# EAGLE design schema_attiny85_Charger_NiMH (EAGLE 7.2.0)
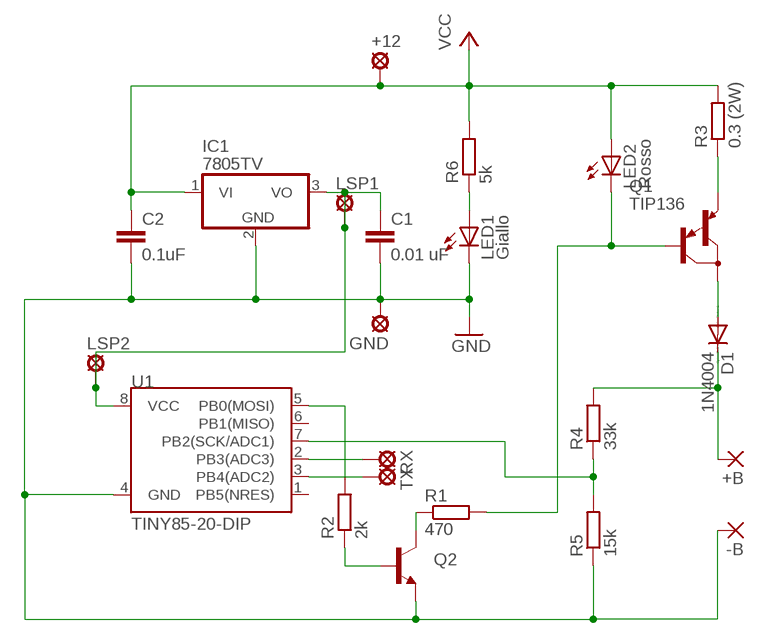
[diagram p0: schematic, sheet 1]

## Parts
+12  LSP10  [LSP10]
+B  1,6/0,9  [1,6/0,9]
-B  1,6/0,9  [1,6/0,9]
C1  0.01 uF  C-EU050-025X075  [C050-025X075]
C2  0.1uF  C-EU050-025X075  [C050-025X075]
D1  1N4004  [DO41-10]
GND  LSP10  [LSP10]
IC1  7805TV  [TO220V]
LED1  Giallo  LED5MM  [LED5MM]
LED2  Rosso  LED5MM  [LED5MM]
LSP1  LSP10  [LSP10]
LSP2  LSP10  [LSP10]
Q1  TIP136  [TO220]
Q2  TRANSISTOR_NPNBC547  [TO-92-AMMO]
R1  470  R-EU_0204/7  [0204/7]
R2  2k  R-EU_0204/7  [0204/7]
R3  0.3 (2W)  R-EU_0204/7  [0204/7]
R4  33k  R-EU_0204/7  [0204/7]
R5  15k  R-EU_0204/7  [0204/7]
R6  5k  R-EU_0204/7  [0204/7]
RX  LSP10  [LSP10]
TX  LSP10  [LSP10]
U1  TINY85-20-DIP  ATTINY45TINY85-20-DIP  [DIP08]

## Nets
GND232: -B.1(P) C1.2 C2.2 GND.MP IC1.2(GND) LED1.K(C) Q2.3(E) R5.1 U1.4(GND) ; supply symbol labelled GND
N$1: Q2.2(B) R2.1
N$2: C1.1 IC1.3(VO) LSP1.MP LSP2.MP U1.8(VCC)
N$3: D1.A Q1.2(C)
N$4: LED1.A R6.1
N$5: LED2.K(C) Q1.1(B) R1.2
N$6: Q1.3(E) R3.1
N$7: RX.MP U1.2(PB3(ADC3))
N$8: +B.1(P) D1.C R4.2
N$9: R4.1 R5.2 U1.7(PB2(SCK/ADC1))
N$10: TX.MP U1.3(PB4(ADC2))
N$13: Q2.1(C) R1.1
N$15: R2.2 U1.5(PB0(MOSI))
VCC: +12.MP C2.1 IC1.1(VI) LED2.A R3.2 R6.2
Unconnected: U1.1(PB5(NRES)) U1.6(PB1(MISO))

## Library data of the parts
+12 GND LSP1 LSP2 RX TX = solpad:LSP10: SOLDER PAD drill 1.0 mm, distributor Buerklin, 12H555
+B -B = wirepad:1,6/0,9: THROUGH-HOLE PAD
C1 C2 = rcl:C-EU: CAPACITOR, European symbol
D1 = diode:1N4004: DIODE general purpose rectifier, 1 A
IC1 = linear:78*: Positive VOLTAGE REGULATOR Source: http://cache.national.com/ds/LM/LM78L05.pdf http://www.fairchildsemi.com/ds/LM/LM7805.pdf
LED1 LED2 = led:LED: LED OSRAM: - CHIPLED LG R971, LG N971, LY N971, LG Q971, LY Q971, LO R971, LY R971 LH N974, LH R974 LS Q976, LO Q976, LY Q976 LO Q996 - Hyper CHIPLED LW Q18S LB Q993, LB Q99A, LB R99A - SideLED LS A670, LO A670, LY A670, LG A670, LP A670 LB A673, LV A673, LT A673, LW A673 LH A674 LY A675 LS A676, LA A676, LO A676, LY A676, LW A676 LS A679, LY A679, LG A679 - Hyper Micro SIDELED® LS Y876, LA Y876, LO Y876, LY Y876 LT Y87S - SmartLED LW L88C, LW L88S LB L89C, LB L89S, LG L890 LS L89K, LO L89K, LY L89K LS L896, LA L896, LO L896, LY L896 - TOPLED LS T670, LO T670, LY T670, LG T670, LP T670 LSG T670, LSP T670, LSY T670, LOP T670, LYG T670 LG T671, LOG T671, LSG T671 LB T673, LV T673, LT T673, LW T673 LH T674 LS T676, LA T676, LO T676, LY T676, LB T676, LH T676, LSB T676, LW T676 LB T67C, LV T67C, LT T67C, LS T67K, LO T67K, LY T67K, LW E67C LS E67B, LA E67B, LO E67B, LY E67B, LB E67C, LV E67C, LT E67C LW T67C LS T679, LY T679, LG T679 LS T770, LO T770, LY T770, LG T770, LP T770 LB T773, LV T773, LT T773, LW T773 LH T774 LS E675, LA E675, LY E675, LS T675 LS T776, LA T776, LO T776, LY T776, LB T776 LHGB T686 LT T68C, LB T68C - Hyper Mini TOPLED® LB M676 - Mini TOPLED Santana® LG M470 LS M47K, LO M47K, LY M47K Source: http://www.osram.convergy.de LUXEON: - LUMILED® LXK2-PW12-R00, LXK2-PW12-S00, LXK2-PW14-U00, LXK2-PW14-V00 LXK2-PM12-R00, LXK2-PM12-S00, LXK2-PM14-U00 LXK2-PE12-Q00, LXK2-PE12-R00, LXK2-PE12-S00, LXK2-PE14-T00, LXK2-PE14-U00 LXK2-PB12-K00, LXK2-PB12-L00, LXK2-PB12-M00, LXK2-PB14-N00, LXK2-PB14-P00, LXK2-PB14-Q00 LXK2-PR12-L00, LXK2-PR12-M00, LXK2-PR14-Q00, LXK2-PR14-R00 LXK2-PD12-Q00, LXK2-PD12-R00, LXK2-PD12-S00 LXK2-PH12-R00, LXK2-PH12-S00 LXK2-PL12-P00, LXK2-PL12-Q00, LXK2-PL12-R00 Source: www.luxeon.com KINGBRIGHT: KA-3528ASYC Source: www.kingbright.com
Q1 = transistor-pnp:TIP136: PNP Darlington Transistor
Q2 = SparkFun-DiscreteSemi:TRANSISTOR_NPN: Generic NPN BJT MMBT2222A - TRANS-08049 (SOT-23, 1A 40V) MPSA42 - TRANS-09116 (SOT-23, 500mA 300V) MMBT5088LT1G - TRANS-11160 (SOT-23, 50 mA 30V) BC547 - COM-08928 <http://www.sparkfun.com/products/8928> (TO-92 45V 100mA) (1.Collector 2.Base 3.Emitter) 2N3904 - COM-00521 <http://www.sparkfun.com/products/521> (TO-92 40V 200mA) (1.Emitter 2.Base 3.Collector) P2N2222A - COM-12852 <http://www.sparkfun.com/products/12852> (TO-92 40V 600mA) (1.Collector 2.Base 3.Emitter)
R1-R6 = resistor:R-EU_: RESISTOR, European symbol
U1 = SparkFun-DigitalIC:ATTINY45: Atmel 8-pin 2/4/8kB flash uC; PROD_ID: IC-09445

## Board
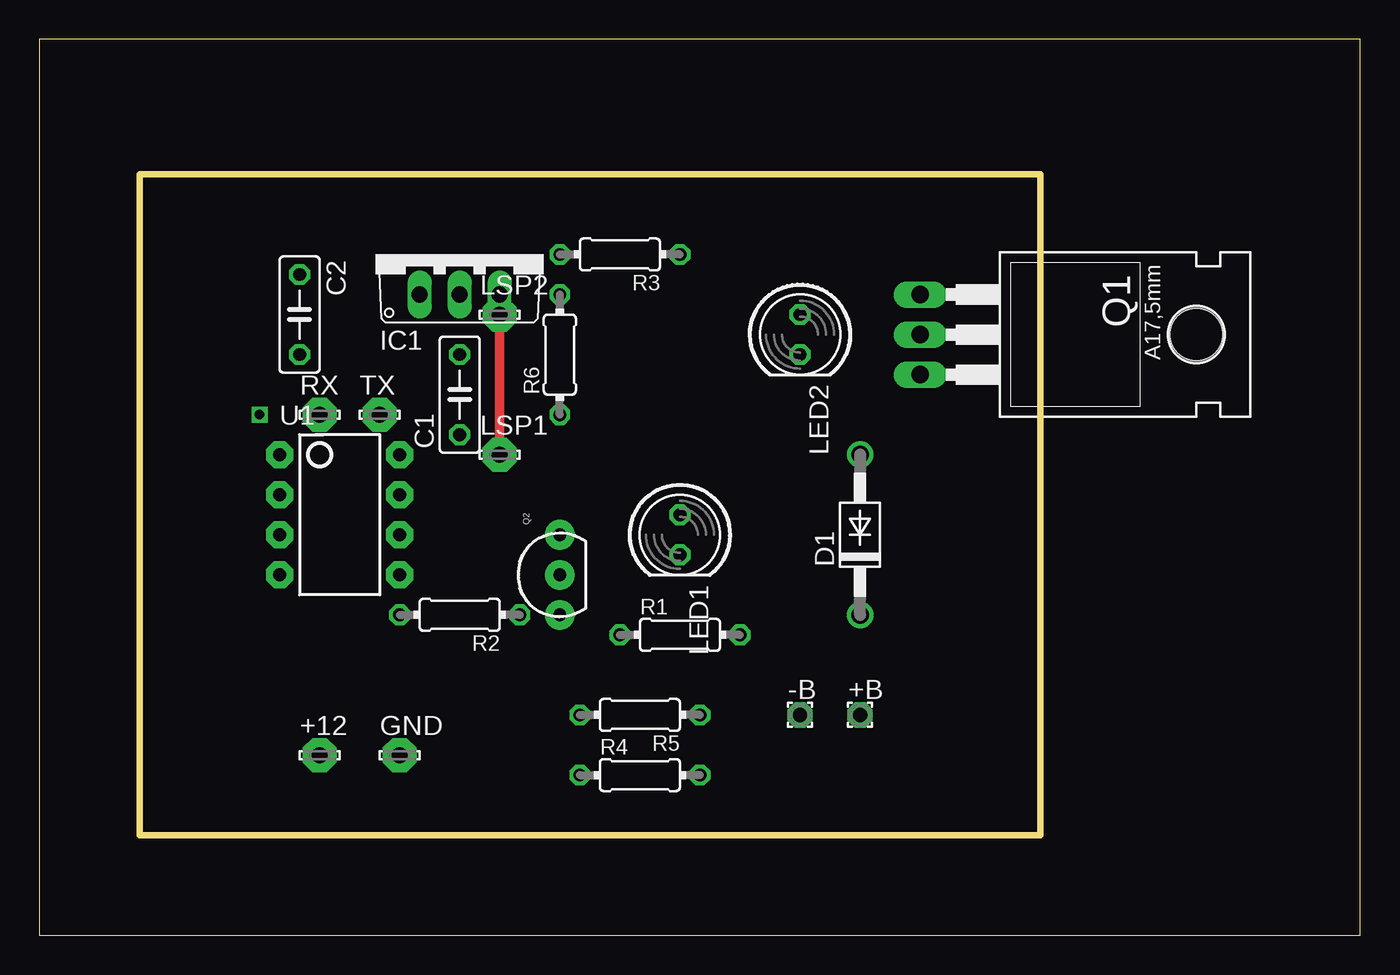
[diagram p1: board, top side]
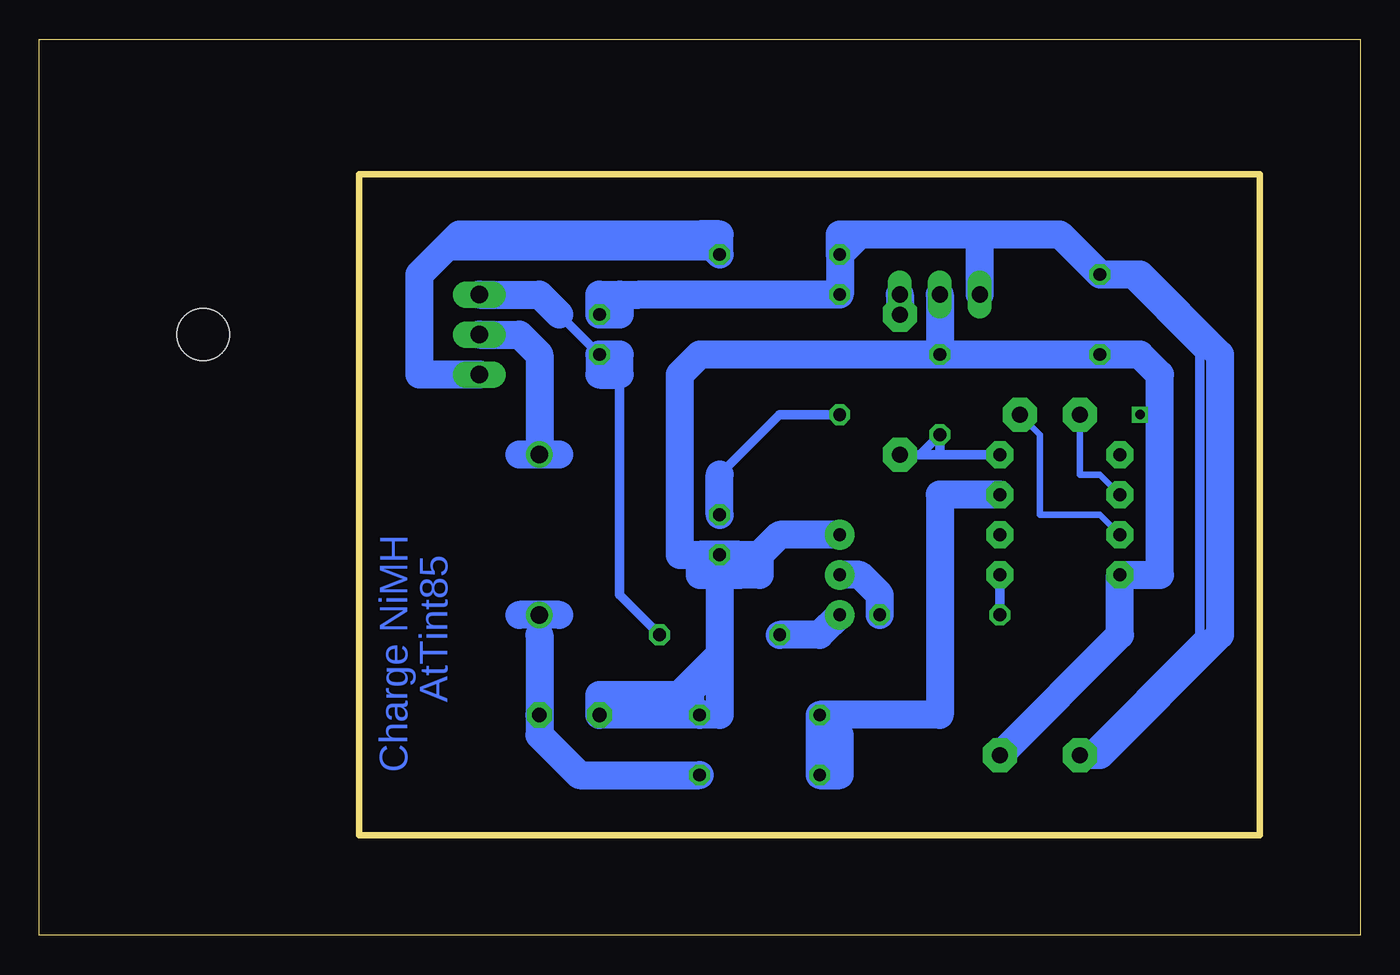
[diagram p2: board, bottom side, seen from below]

Size 83.8 x 56.82 mm. Coordinates in mm from the lower left corner, seen from the top.
Outline: 0,0 83.8,0 83.8,56.82 0,56.82 0,0
Outline: 6.35,48.26 6.35,6.35 63.5,6.35 63.5,48.26 6.35,48.26
Copper layers (1*16): Top 0.035mm / dielectric 1.5mm / Bottom 0.035mm
Design rules "default": minimum track width 10mil, minimum drill 24mil, track to track 8mil, track to pad 8mil, pad to pad 8mil, via to via 8mil, smd to smd 8mil, copper to edge 40mil, drill to drill 8mil, minimum pad ring 10mil, minimum via ring 8mil, stop-mask expansion 4mil, vias tented up to drill 0mil, thermal gap 10mil

### Footprints (pad centres in the part's own frame; a part is rotated, then mirrored left to right if it is on the bottom)
LSP10 = drill 1.016 pad 2.159 octagon: MP 0,0
1,6/0,9 = drill 0.914 pad 1.6 octagon: 1 0,0
C050-025X075 = drill 0.813 octagon: 1 -2.54,0; 2 2.54,0
DO41-10 = drill 1.118: A 5.08,0; C -5.08,0
TO220V = drill 1.016 long: 1 -2.54,-2.54; 2 0,-2.54; 3 2.54,-2.54
LED5MM = drill 0.813 octagon: A -1.27,0; K 1.27,0
TO220 = drill 1.118 long: 1 -2.54,-6.35; 2 0,-6.35; 3 2.54,-6.35 | hole 3.302: 0,11.176
TO-92-AMMO = drill 0.813 pad 1.88: 1 -2.54,0; 2 0,0; 3 2.54,0
0204/7 = drill 0.813 octagon: 1 -3.81,0; 2 3.81,0
DIP08 = drill 0.813 pad 1.727 octagon: 1 -3.81,-3.81; 2 -1.27,-3.81; 3 1.27,-3.81; 4 3.81,-3.81; 5 3.81,3.81; 6 1.27,3.81; 7 -1.27,3.81; 8 -3.81,3.81

### Placement (x,y rotation side)
+12  17.78,11.43 0 top
+B  52.07,13.97 0 top
-B  48.26,13.97 0 top
C1  26.67,34.29 90 top
C2  16.51,39.37 270 top
D1  52.07,25.4 90 top
GND  22.86,11.43 0 top
IC1  26.67,43.18 0 top
LED1  40.64,25.4 270 top
LED2  48.26,38.1 270 top
LSP1  29.21,30.48 0 top
LSP2  29.21,39.37 0 top
Q1  62.23,38.1 270 top
Q2  33.02,22.86 90 top
R1  40.64,19.05 0 top
R2  26.67,20.32 180 top
R3  36.83,43.18 180 top
R4  38.1,10.16 0 top
R5  38.1,13.97 180 top
R6  33.02,36.83 90 top
RX  17.78,33.02 0 top
TX  21.59,33.02 0 top
U1  19.05,26.67 270 top

### Tracks (layer width: path | path; a pad name or v marks a point on that pad's centre or on a via)
GND232  (via drill 0.6)
  Bottom 0.406: v13.97,33.02 12.7,33.02
  Bottom 0.61: U1.4 13.97,22.86 12.7,24.13 12.7,33.02 12.7,35.56 | C2.2 C1.2 41.91,36.83 | 39.37,24.13 LED1.K 41.91,24.13 | 40.64,16.51 41.91,15.24 R5.1
  Bottom 1.778: LED1.K 40.64,22.86 | 40.64,22.86 39.37,22.86 | 39.37,24.13 41.91,24.13 | 41.91,24.13 41.91,22.86 40.64,22.86 | IC1.2 C1.2 | GND.MP 15.24,19.05 U1.4 12.7,22.86 12.7,35.56 13.97,36.83 C2.2 41.91,36.83 43.18,35.56 43.18,24.13 41.91,24.13 | 40.64,22.86 40.64,17.78 | 40.64,17.78 43.18,15.24 | 43.18,15.24 R5.1 | R5.1 -B.1 48.26,15.24 43.18,15.24 | 40.64,17.78 40.64,16.51 40.64,13.97 R5.1 | 38.1,24.13 38.1,22.86 39.37,22.86 | 39.37,22.86 39.37,24.13 | 39.37,24.13 38.1,24.13 | Q2.3 36.83,25.4 38.1,24.13
N$1
  Bottom 1.778: R2.1 30.48,21.59 31.75,22.86 Q2.2
N$2
  Top 0.61: LSP2.MP LSP1.MP
  Bottom 0.61: U1.8 26.67,30.48 | 26.67,30.48 C1.1 27.94,30.48 LSP1.MP 26.67,30.48
  Bottom 1.778: IC1.3 LSP2.MP
N$3
  Bottom 1.778: Q1.2 53.34,38.1 52.07,36.83 D1.A
N$4
  Bottom 0.61: 40.64,29.21 36.83,33.02 R6.1
  Bottom 1.778: LED1.A 40.64,29.21
N$5
  Bottom 0.61: 50.8,39.37 LED2.K 46.99,35.56 46.99,21.59 R1.2
  Bottom 1.778: Q1.1 52.07,40.64 50.8,39.37 | LED2.K 48.26,35.56 46.99,35.56 46.99,36.83 LED2.K
N$6
  Bottom 0.813: R3.1 58.42,43.18
  Bottom 1.778: Q1.3 59.69,35.56 59.69,41.91 58.42,43.18 57.15,44.45 43.18,44.45 41.91,44.45 | 41.91,44.45 R3.1 40.64,44.45 41.91,44.45
N$7
  Bottom 0.406: U1.2 16.51,29.21 17.78,29.21 RX.MP
N$8
  Bottom 0.61: D1.C 52.07,19.05
  Bottom 1.778: 52.07,19.05 +B.1 52.07,12.7 49.53,10.16 R4.2
N$9
  Bottom 1.778: U1.7 26.67,27.94 26.67,13.97 R5.2 R4.1 33.02,10.16 33.02,12.7
N$10
  Bottom 0.406: U1.3 16.51,26.67 20.32,26.67 20.32,31.75 TX.MP
N$11
  Bottom 1.778: 50.8,30.48 53.34,30.48
N$12
  Bottom 1.778: 50.8,20.32 53.34,20.32
N$13
  Bottom 1.778: Q2.1 34.29,19.05 R1.1
N$15
  Bottom 0.61: U1.5 R2.2
VCC
  Bottom 0.61: 19.05,44.45 24.13,44.45 30.48,44.45 | 45.72,40.64 46.99,39.37 | +12.MP 10.16,19.05 10.16,36.83 15.24,41.91 C2.1
  Bottom 1.778: 46.99,40.64 48.26,40.64 LED2.A 46.99,39.37 46.99,40.64 | 46.99,40.64 45.72,40.64 R6.2 R3.2 | IC1.1 24.13,44.45 | R3.2 31.75,44.45 | 31.75,44.45 30.48,44.45 19.05,44.45 C2.1 13.97,41.91 8.89,36.83 8.89,19.05 16.51,11.43 +12.MP | R3.2 33.02,44.45 31.75,44.45

### Text on the board
Bottom: Charge NiMH | AtTint85